# Altium project TSAL_Pedro_Leite.PrjPcb
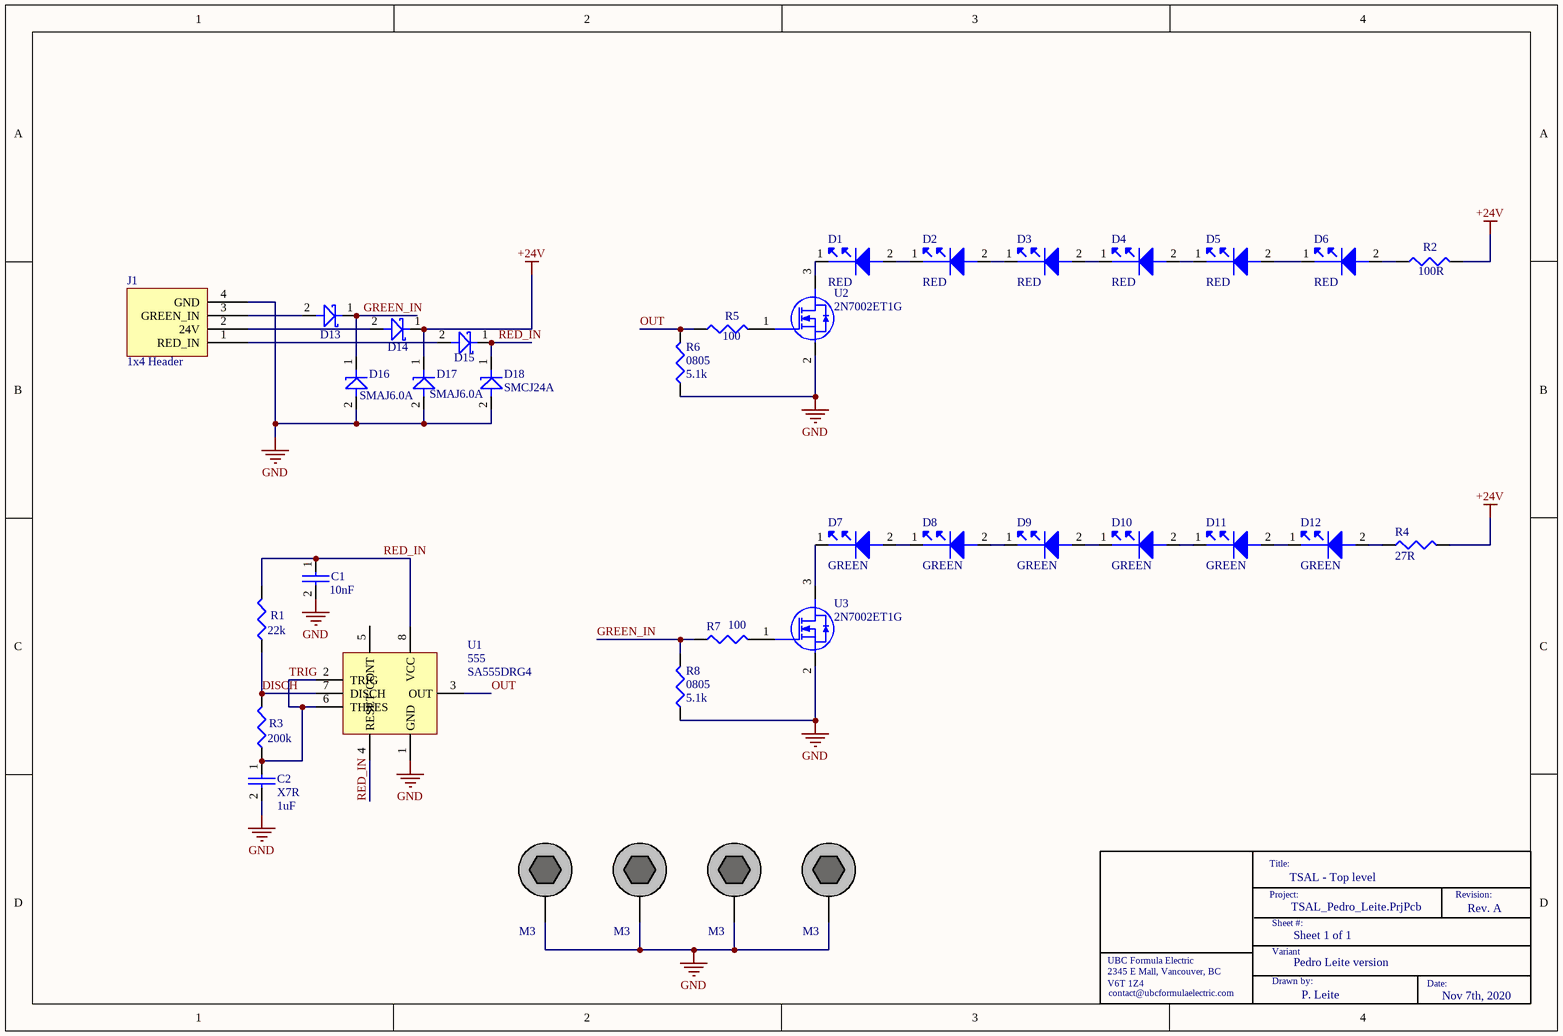
[diagram p0: TSAL_PL.SchDoc]
1 sheet, 37 parts. Net scope: global (net labels, ports and power ports of the same name join across sheets).
Board file: TSAL_PL_R1.PcbDoc

## Sheet TSAL_PL.SchDoc
size A4; Organization: Altium Limited; Address1: L3, 12a Rodborough Rd; Address2: Frenchs Forest; Address3: NSW; Address4: Australia 2086

### Parts
2  M3  [M3 Mounting Hole]
3  M3  [M3 Mounting Hole]
4  M3  [M3 Mounting Hole]
*  Title Box  (value not drawn)
C1  Capacitance: 10nF  [0603 CAPACITOR (TDK C-SERIES)]  (hidden comment: 0603)
C2  X7R  Capacitance: 1uF  [RESC0805X60N]
D1  RED  [RED LED]  (net tie)
D2  RED  [RED LED]  (net tie)
D3  RED  [RED LED]  (net tie)
D4  RED  [RED LED]  (net tie)
D5  RED  [RED LED]  (net tie)
D6  RED  [RED LED]  (net tie)
D7  GREEN  [GREEN LED]  (net tie)
D8  GREEN  [GREEN LED]  (net tie)
D9  GREEN  [GREEN LED]  (net tie)
D10  GREEN  [GREEN LED]  (net tie)
D11  GREEN  [GREEN LED]  (net tie)
D12  GREEN  [GREEN LED]  (net tie)
D13  NRVTS260ESFT1G  [ON NRVTS260ESFT1G]  (value not drawn)
D14  NRVTS260ESFT1G  [ON NRVTS260ESFT1G]  (value not drawn)
D15  NRVTS260ESFT1G  [ON NRVTS260ESFT1G]  (value not drawn)
D16  SMAJ6.0A  [LITTELFUSE SMAJ6.0A]
D17  SMAJ6.0A  [LITTELFUSE SMAJ6.0A]
D18  SMCJ24A  [LITTELFUSE SMCJ24A]
J1  1x4 Header  [HDR1x4]
M1  M3  [M3 Mounting Hole]
R1  Resistance: 22k  [0603 RESISTOR (YAGEO)]  (hidden comment: 0603)
R2  Resistence: 100R  [2010 RESISTOR (YAGEO)]  (hidden comment: 2010)
R3  Resistance: 200k  [0603 RESISTOR (YAGEO)]  (hidden comment: 0603)
R4  Resistance: 27R  [0805 RESISTOR (YAGEO)]  (hidden comment: RL1220S-270-F)
R5  Resistance: 100  [0805 RESISTOR (YAGEO)]  (hidden comment: 0805)
R6  0805  Resistance: 5.1k  [0805 RESISTOR (YAGEO)]
R7  Resistance: 100  [0805 RESISTOR (YAGEO)]  (hidden comment: 0805)
R8  0805  Resistance: 5.1k  [0805 RESISTOR (YAGEO)]
U1  555  [SOIC-8]
U2  2N7002ET1G  [2N7002ET1G]
U3  2N7002ET1G  [2N7002ET1G]

### Nets
+24V: D14.1 D17.1 R2.2 R4.2
GND: 2.1 3.1 4.1 C1.2 C2.2 D16.2 D17.2 D18.2 J1.4(GND) M1.1 R6.1 R8.1 U1.1(GND) U2.2(S) U3.2(S)
DISCH: R1.1 R3.2 U1.7(DISCH)
GREEN_IN: D13.1 D16.1 R7.1 R8.2
OUT: R5.1 R6.2 U1.3(OUT)
RED_IN: C1.1 D15.1 D18.1 R1.2 U1.4(RESET) U1.8(VCC)
TRIG: C2.1 R3.1 U1.2(TRIG) U1.6(THRES)
NetD1_1: D1.1 U2.3(D)
NetD1_2: D1.2 D2.1
NetD2_2: D2.2 D3.1
NetD3_2: D3.2 D4.1
NetD4_2: D4.2 D5.1
NetD5_2: D5.2 D6.1
NetD6_2: D6.2 R2.1
NetD7_1: D7.1 U3.3(D)
NetD7_2: D7.2 D8.1
NetD8_2: D8.2 D9.1
NetD9_2: D9.2 D10.1
NetD10_2: D10.2 D11.1
NetD11_2: D11.2 D12.1
NetD12_2: D12.2 R4.1
NetD13_2: D13.2 J1.3(GREEN_IN)
NetD14_2: D14.2 J1.2(24V)
NetD15_2: D15.2 J1.1(RED_IN)
NetR5_2: R5.2 U2.1(G)
NetR7_2: R7.2 U3.1(G)

Not connected (* = marked no-connect by the designer): U1 5(CONT)

### Notes on the sheet
- (in symbol Title Box) Title:; TSAL - Top level; Project:; Revision:; TSAL_Pedro_Leite.PrjPcb; Rev. A; Sheet #:; Sheet 1 of 1; Variant; UBC Formula Electric; Pedro Leite version; 2345 E Mall, Vancouver, BC; V6T 1Z4; Drawn by:; Date:; contact@ubcformulaelectric.com; P. Leite; Nov 7th, 2020

### Library data of the parts
2-4 M1 = M3 Mounting Hole
C1 = CL10B103KB8NNNC: Cap Ceramic 0.01uF 50VDC X7R 10% SMD 0603 Paper T/R; Manufacturer: Samsung; Voltage Rating (DC): 50V; Supplier 1: Digi-Key; Manufacturer Part Number: CL10B103KB8NNNC; RoHS: Yes; Category: Ceramic Capacitors; Stock 1: 3003971; Pricing 1: 1=0.10000, 10=0.02700, 50=0.01480, 100=0.01210, 500=0.00866, 1000=0.00681 (USD); Mount: Surface Mount; Case/Package: 0603; Case Code (Metric): 1608; Case Code (Imperial): 0603; Material: Ceramic; Contact Plating: Tin; Min Operating Temperature: -55°C; Max Operating Temperature: 125°C; Dielectric: X7R; Voltage: 50V; Tolerance: 10%; Voltage Rating: 50V; Package Quantity: 1; Packaging: Cut Tape; Length: 1.6mm; Height: 0.8mm; Depth: 0.8mm; Thickness: 0.035inch; Width: 0.031inch; Radiation Hardening: No; Lead Free: Lead Free; ComponentLink1URL: https://datasheet.ciiva.com/15195/getdatasheetpartid-357415-15195721.pdf?src-supplier=Verical; ComponentLink1Description: https://datasheet.ciiva.com/15195/getdatasheetpartid-357415-15195721.pdf?src-supplier=Verical; ComponentLink2URL: https://datasheet.ciiva.com/29198/457455-da-01-en-vs-kondensator-0603-29198644.pdf?src-supplier=Conrad; ComponentLink2Description: https://datasheet.ciiva.com/29198/457455-da-01-en-vs-kondensator-0603-29198644.pdf?src-supplier=Conrad; ComponentLink3URL: https://datasheet.ciiva.com/20173/71-0315-20173334.pdf?src-supplier=Rapid+Electronics; ComponentLink3Description: https://datasheet.ciiva.com/20173/71-0315-20173334.pdf?src-supplier=Rapid+Electronics; Supplier Part Number 1: 1276-1009-1-ND
C2 = CC0805KKX7R6BB105: YAGEO - CC0805KKX7R6BB105 - Keramikvielschichtkondensator, SMD, 1 µF, 10 V, 0805 [Metrisch 2012], ± 10%, X7R, Baureihe CC; Dielectric Material: Ceramic; Voltage Rating: 10V; Supplier 1: Digi-Key; Manufacturer: Yageo; Manufacturer Part Number: CC0805KKX7R6BB105; RoHS: Yes; Category: Ceramic Capacitors; Stock 1: 620418; Pricing 1: 1=0.16000, 10=0.11300, 50=0.06440, 100=0.05340, 500=0.03740, 1000=0.03097 (USD); Mount: Surface Mount; Case/Package: 0805; Number of Pins: 2; Case Code (Imperial): 0805; Case Code (Metric): 2012; Min Operating Temperature: -55°C; Max Operating Temperature: 125°C; Tolerance: 10%; Voltage Rating (DC): 10V; Packaging: Tape and Reel; Package Quantity: 1; Dielectric: X7R; Termination: SMD/SMT; Resistor Type: Ceramic; Length: 2mm; Width: 1.25mm; Height: 1.25mm; Thickness: 0.057inch; Depth: 1.25mm; Radiation Hardening: No; REACH SVHC: Unknown; Lead Free: Lead Free; Halogen Free: Halogen Free; ComponentLink1URL: https://datasheet.ciiva.com/13389/upy-gp-np0-16v-to-50v-8-13389349.pdf?src-supplier=Mouser; ComponentLink1Description: https://datasheet.ciiva.com/13389/upy-gp-np0-16v-to-50v-8-13389349.pdf?src-supplier=Mouser; ComponentLink2URL: https://datasheet.ciiva.com/46430/1734573-46430165.pdf?src-supplier=Element14; ComponentLink2Description: https://datasheet.ciiva.com/46430/1734573-46430165.pdf?src-supplier=Element14; ComponentLink3URL: https://datasheet.ciiva.com/28450/1489800-28450742.pdf?src-supplier=Element14; ComponentLink3Description: https://datasheet.ciiva.com/28450/1489800-28450742.pdf?src-supplier=Element14; ComponentLink4URL: https://datasheet.ciiva.com/7978/1489800-7978199.pdf?src-supplier=Element14; ComponentLink4Description: https://datasheet.ciiva.com/7978/1489800-7978199.pdf?src-supplier=Element14; ComponentLink5URL: https://datasheet.ciiva.com/176/mlccorderingcode-176908.pdf?src-supplier=Digi-Key; ComponentLink5Description: https://datasheet.ciiva.com/176/mlccorderingcode-176908.pdf?src-supplier=Digi-Key; ComponentLink6URL: https://datasheet.ciiva.com/11583/upy-gphc-x7r-6-3v-to-50v-8-11583596.pdf?src-supplier=Avnet; ComponentLink6Description: https://datasheet.ciiva.com/11583/upy-gphc-x7r-6-3v-to-50v-8-11583596.pdf?src-supplier=Avnet; ComponentLink7URL: https://datasheet.ciiva.com/176/mlccorderingcode-176909.pdf?src-supplier=Digi-Key; ComponentLink7Description: https://datasheet.ciiva.com/176/mlccorderingcode-176909.pdf?src-supplier=Digi-Key; ComponentLink8URL: https://datasheet.ciiva.com/8033/1489800-8033973.pdf?src-supplier=Element14; ComponentLink8Description: https://datasheet.ciiva.com/8033/1489800-8033973.pdf?src-supplier=Element14; ComponentLink9URL: https://datasheet.ciiva.com/17437/upy-gphc-x7r-6-3v-to-50v-8-17437525.pdf?src-supplier=Avnet+Europe; ComponentLink9Description: https://datasheet.ciiva.com/17437/upy-gphc-x7r-6-3v-to-50v-8-17437525.pdf?src-supplier=Avnet+Europe; ComponentLink10URL: https://datasheet.ciiva.com/176/mlccorderingcode-176907.pdf?src-supplier=Digi-Key; ComponentLink10Description: https://datasheet.ciiva.com/176/mlccorderingcode-176907.pdf?src-supplier=Digi-Key; ComponentLink11URL: https://datasheet.ciiva.com/8033/1489800-8033998.pdf?src-supplier=Element14; ComponentLink11Description: https://datasheet.ciiva.com/8033/1489800-8033998.pdf?src-supplier=Element14; Supplier Part Number 1: 311-1458-1-ND
D1-D6 = OVS5MRBCR4: LED 0.33W RED WTR CLR 3.5MM; Manufacturer: TT Optek; Reverse Voltage: 12V; Test Current: 150mA; Max Current Rating: 200mA; Dominant Wavelength: 625nm; Power Dissipation: 750mW; Number of Elements: 1; Max Power Dissipation: 330mW; Viewing Angle: 120°; Lens Style: Clear,Diffused,Colorless; Forward Voltage: 2.2V; Luminous Intensity: 7150mcd; Power Rating: 500mW; Supplier 1: Digi-Key; Manufacturer Part Number: OVS5MRBCR4; RoHS: Yes; Category: LEDs; Stock 1: 10132; Pricing 1: 1=0.96000, 100=0.92400, 250=0.88000, 500=0.85800 (USD); Mount: Surface Mount; Case/Package: SMD/SMT; Number of Pins: 2; Color: Red; Min Operating Temperature: -40°C; Max Operating Temperature: 100°C; Wavelength: 625nm; Packaging: Cut Tape; Package Quantity: 1; Illumination Color: Red; Forward Current: 200mA; Length: 3.5mm; Depth: 3.5mm; Lead Free: Lead Free; REACH SVHC: No SVHC; ComponentLink1URL: https://datasheet.ciiva.com/2126/ovs5mabcr4-2126832.pdf?src-supplier=Digi-Key; ComponentLink1Description: https://datasheet.ciiva.com/2126/ovs5mabcr4-2126832.pdf?src-supplier=Digi-Key; ComponentLink2URL: https://datasheet.ciiva.com/16224/ovs5mrbcr4-16224208.pdf?src-supplier=Future+Electronics; ComponentLink2Description: https://datasheet.ciiva.com/16224/ovs5mrbcr4-16224208.pdf?src-supplier=Future+Electronics; ComponentLink3URL: https://datasheet.ciiva.com/2126/ovs5mabcr4-2126833.pdf?src-supplier=Digi-Key; ComponentLink3Description: https://datasheet.ciiva.com/2126/ovs5mabcr4-2126833.pdf?src-supplier=Digi-Key; ComponentLink4URL: https://datasheet.ciiva.com/46403/ovs5mabcr4-46403613.pdf?src-supplier=Element14; ComponentLink4Description: https://datasheet.ciiva.com/46403/ovs5mabcr4-46403613.pdf?src-supplier=Element14; ComponentLink5URL: https://datasheet.ciiva.com/2126/ovs5mabcr4-2126831.pdf?src-supplier=Digi-Key; ComponentLink5Description: https://datasheet.ciiva.com/2126/ovs5mabcr4-2126831.pdf?src-supplier=Digi-Key; Supplier Part Number 1: 365-1546-1-ND
D7-D12 = XZDG25X109FS: Led 3.5X2.8 0.5W SMD Green; Manufacturer: SunLED; Lens Color: Colorless; Lens Style: Round,Flat; Lens Transparency: Clear; Luminous Intensity: 6990mcd; Forward Voltage: 3.5V; Test Current: 150mA; Viewing Angle: 120°; Dominant Wavelength: 525nm; Lens Size: 2.5mm; Supplier 1: Digi-Key; Manufacturer Part Number: XZDG25X109FS; RoHS: No; Category: LEDs; Stock 1: 1496; Pricing 1: 1=1.83000, 10=1.61300, 100=0.93630, 500=0.84640, 1000=0.72738 (USD); Mount: Surface Mount; Case/Package: 1411; Color: Green; Case Code (Imperial): 1411; Case Code (Metric): 3528; Packaging: Cut Tape; Length: 3.5mm; Width: 2.8mm; Height: 1.05mm; ComponentLink1URL: http://www.sunledusa.com/products/spec/XZDG25X109FS.pdf?src-supplier=Digi-Key; ComponentLink1Description: http://www.sunledusa.com/products/spec/XZDG25X109FS.pdf?src-supplier=Digi-Key; ComponentLink2URL: https://www.sunledusa.com/products/spec/XZDG25X109FS.pdf?src-supplier=Digi-Key; ComponentLink2Description: https://www.sunledusa.com/products/spec/XZDG25X109FS.pdf?src-supplier=Digi-Key; Supplier Part Number 1: 1497-1345-1-ND
D13-D15 = NRVTS260ESFT1G: ON SEMICONDUCTOR - NRVTS260ESFT1G - Schottky Rectifier, 60 V, 2 A, Single, SOD-123, 2 Pins, 650 mV; Max Reverse Voltage (DC): 60V; Average Rectified Current: 2A; Max Reverse Current: 12uA; Forward Voltage: 650mV; Max Forward Surge Current (Ifsm): 25A; Peak Non-Repetitive Surge Current: 50A; Supplier 1: Digi-Key; Manufacturer: ON Semiconductor; Manufacturer Part Number: NRVTS260ESFT1G; RoHS: Yes; Category: Schottky Diodes; Pricing 1: 1=0.34000, 10=0.22100, 100=0.11060, 500=0.09164, 1000=0.06004 (USD); Mount: Surface Mount; Case/Package: SOD; Number of Pins: 2; Min Operating Temperature: -65°C; Max Operating Temperature: 175°C; Packaging: Cut Tape; Reverse Voltage (DC): 60V; Forward Current: 2A; Max Repetitive Reverse Voltage (Vrrm): 60V; Element Configuration: Single; Package Quantity: 1; Length: 2.9mm; Width: 1.8mm; Height: 0.88mm; REACH SVHC: No SVHC; Lead Free: Lead Free; ComponentLink1URL: https://datasheet.ciiva.com/53019/nts260esf-d-53019548.pdf?src-supplier=Digi-Key; ComponentLink1Description: https://datasheet.ciiva.com/53019/nts260esf-d-53019548.pdf?src-supplier=Digi-Key; Supplier Part Number 1: NRVTS260ESFT1GOSCT-ND
D16 D17 = SMAJ6.0A: In a Pack of 25, Littelfuse SMAJ6.0A, Uni-Directional TVS Diode, 400W, 2-Pin DO-214AC; Direction: Unidirectional; Operating Supply Voltage: 6V; Max Surge Current: 38.8A; Reverse Breakdown Voltage: 66.7V; Number of Unidirectional Channels: 1; Min Breakdown Voltage: 6.67V; Clamping Voltage: 10.3V; Power Line Protection: No; Max Breakdown Voltage: 7.37V; Peak Pulse Current: 4.1A; Test Current: 1mA; Max Power Dissipation: 3.3W; Leakage Current: 1uA; Current: 41A; Voltage: 60V; Supplier 1: Digi-Key; Manufacturer: Littelfuse; Manufacturer Part Number: SMAJ6.0A; RoHS: Yes; Category: TVS Diodes; Stock 1: 50756; Pricing 1: 1=0.36000, 10=0.24800, 100=0.14180, 500=0.10800, 1000=0.07875, 2000=0.07650 (USD); Mount: Surface Mount; Number of Pins: 2; Min Operating Temperature: -55°C; Max Operating Temperature: 150°C; Package Quantity: 1; Packaging: Cut Tape; Reverse Standoff Voltage: 6V; Peak Pulse Power: 400W; Breakdown Voltage: 6.67V; Number of Channels: 1; Polarity: Unidirectional; Termination: SMD/SMT; Number of Elements: 1; Power Dissipation: 400W; Voltage Rating (DC): 6V; Resistor Type: Zener; Length: 5.28mm; Width: 2.79mm; Height: 2.29mm; Radiation Hardening: No; REACH SVHC: No SVHC; Lead Free: Lead Free; ComponentLink1URL: https://datasheet.ciiva.com/330/littelfuse-tvs-diode-smaj-datasheet-pdf-330721.pdf?src-supplier=Digi-Key; ComponentLink1Description: https://datasheet.ciiva.com/330/littelfuse-tvs-diode-smaj-datasheet-pdf-330721.pdf?src-supplier=Digi-Key; ComponentLink2URL: https://datasheet.ciiva.com/330/littelfuse-tvs-diode-smaj-datasheet-pdf-330722.pdf?src-supplier=Digi-Key; ComponentLink2Description: https://datasheet.ciiva.com/330/littelfuse-tvs-diode-smaj-datasheet-pdf-330722.pdf?src-supplier=Digi-Key; ComponentLink3URL: https://datasheet.ciiva.com/330/littelfuse-tvs-diode-smaj-datasheet-pdf-330723.pdf?src-supplier=Digi-Key; ComponentLink3Description: https://datasheet.ciiva.com/330/littelfuse-tvs-diode-smaj-datasheet-pdf-330723.pdf?src-supplier=Digi-Key; ComponentLink4URL: https://datasheet.ciiva.com/330/littelfuse-tvs-diode-smaj-datasheet-pdf-330712.pdf?src-supplier=Digi-Key; ComponentLink4Description: https://datasheet.ciiva.com/330/littelfuse-tvs-diode-smaj-datasheet-pdf-330712.pdf?src-supplier=Digi-Key; ComponentLink5URL: https://datasheet.ciiva.com/28473/607617-28473464.pdf?src-supplier=Element14; ComponentLink5Description: https://datasheet.ciiva.com/28473/607617-28473464.pdf?src-supplier=Element14; ComponentLink6URL: https://datasheet.ciiva.com/330/littelfuse-tvs-diode-smaj-datasheet-pdf-330713.pdf?src-supplier=Digi-Key; ComponentLink6Description: https://datasheet.ciiva.com/330/littelfuse-tvs-diode-smaj-datasheet-pdf-330713.pdf?src-supplier=Digi-Key; ComponentLink7URL: https://datasheet.ciiva.com/16391/littelfuse-tvs-diode-smaj-16391801.pdf?src-supplier=Future+Electronics; ComponentLink7Description: https://datasheet.ciiva.com/16391/littelfuse-tvs-diode-smaj-16391801.pdf?src-supplier=Future+Electronics; ComponentLink8URL: https://datasheet.ciiva.com/16487/littelfuse-tvs-diode-smaj-16487499.pdf?src-supplier=Future+Electronics; ComponentLink8Description: https://datasheet.ciiva.com/16487/littelfuse-tvs-diode-smaj-16487499.pdf?src-supplier=Future+Electronics; Supplier Part Number 1: SMAJ6.0ALFCT-ND
D18 = SMCJ24A: LITTELFUSE - SMCJ24A - TVS Diode, TRANSZORB SMCJ Series, Unidirectional, 24 V, 38.9 V, DO-214AB (SMC), 2 Pins; Operating Supply Voltage: 24V; Max Surge Current: 38.6A; Clamping Voltage: 38.9V; Peak Pulse Power: 1.5kW; Number of Channels: 1; Breakdown Voltage: 26.7V; Power Line Protection: No; Max Breakdown Voltage: 29.5V; Test Current: 1mA; Max Reverse Leakage Current: 1uA; Max Power Dissipation: 6.5W; Element Configuration: Single; Supplier 1: Digi-Key; Manufacturer: Littelfuse; Manufacturer Part Number: SMCJ24A; RoHS: Yes; Category: Diodes; Stock 1: 17092; Pricing 1: 1=0.55000, 10=0.43800, 100=0.31250, 500=0.23750, 1000=0.18750 (USD); Mount: Surface Mount; Number of Pins: 2; Min Operating Temperature: -65°C; Max Operating Temperature: 150°C; Packaging: Cut Tape; Package Quantity: 1; Polarity: Unidirectional; Voltage Rating (DC): 24V; Direction: Unidirectional; Reverse Breakdown Voltage: 26.7V; Number of Elements: 1; Number of Unidirectional Channels: 1; Reverse Standoff Voltage: 24V; Min Breakdown Voltage: 26.7V; Termination: SMD/SMT; Power Dissipation: 1.5kW; Peak Pulse Current: 38.6A; Leakage Current: 1uA; Resistor Type: Zener; Length: 7.11mm; Width: 6.22mm; Height: 2.417mm; REACH SVHC: No SVHC; Lead Free: Lead Free; ComponentLink1URL: https://datasheet.ciiva.com/341/littelfuse-tvs-diode-smcj-datasheet-pdf-341029.pdf?src-supplier=Digi-Key; ComponentLink1Description: https://datasheet.ciiva.com/341/littelfuse-tvs-diode-smcj-datasheet-pdf-341029.pdf?src-supplier=Digi-Key; ComponentLink2URL: https://datasheet.ciiva.com/8062/littelfuse-tvs-diode-smcj-8062373.pdf?src-supplier=Element14; ComponentLink2Description: https://datasheet.ciiva.com/8062/littelfuse-tvs-diode-smcj-8062373.pdf?src-supplier=Element14; ComponentLink3URL: https://datasheet.ciiva.com/341/littelfuse-tvs-diode-smcj-datasheet-pdf-341030.pdf?src-supplier=Digi-Key; ComponentLink3Description: https://datasheet.ciiva.com/341/littelfuse-tvs-diode-smcj-datasheet-pdf-341030.pdf?src-supplier=Digi-Key; ComponentLink4URL: https://datasheet.ciiva.com/341/littelfuse-tvs-diode-smcj-datasheet-pdf-341031.pdf?src-supplier=Digi-Key; ComponentLink4Description: https://datasheet.ciiva.com/341/littelfuse-tvs-diode-smcj-datasheet-pdf-341031.pdf?src-supplier=Digi-Key; Supplier Part Number 1: SMCJ24ALFCT-ND
J1 = 22-27-2041: Conn Wire to Board HDR 4 POS 2.54mm Solder ST Thru-Hole Bag; Manufacturer: Molex; Number of Positions: 4; Connector Type: Male Pin; Gender: Male; Contact Resistance: 10mR; Supplier 1: Digi-Key; Manufacturer Part Number: 22-27-2041; RoHS: Yes; Category: Headers and Wire Housings; Stock 1: 5089; Pricing 1: 1=0.40000, 10=0.38300, 100=0.26800, 500=0.22974, 1000=0.19145, 5000=0.16410, 10000=0.15316 (USD); Mount: Surface Mount; Color: Natural; Housing Color: White; Housing Material: Nylon; Contact Material: Brass; Contact Plating: Tin,Copper; Min Operating Temperature: 0°C; Max Operating Temperature: 75°C; Number of Rows: 1; Packaging: Cut Tape; Termination: Solder; Orientation: Straight; Number of Contacts: 4; Fastening Type: Friction; Length: 10.16mm; Pitch: 2.54mm; Depth: 5.8mm; Contact Mating Length: 0.295inch; ComponentLink1URL: https://datasheet.ciiva.com/6813/022272021-sd-6813678.pdf?src-supplier=Digi-Key; ComponentLink1Description: https://datasheet.ciiva.com/6813/022272021-sd-6813678.pdf?src-supplier=Digi-Key; ComponentLink2URL: https://datasheet.ciiva.com/7844/1625756-7844114.pdf?src-supplier=Element14; ComponentLink2Description: https://datasheet.ciiva.com/7844/1625756-7844114.pdf?src-supplier=Element14; ComponentLink3URL: https://datasheet.ciiva.com/11746/0900766b80462714-11746241.pdf?src-supplier=RSComponents; ComponentLink3Description: https://datasheet.ciiva.com/11746/0900766b80462714-11746241.pdf?src-supplier=RSComponents; ComponentLink4URL: https://datasheet.ciiva.com/20207/22-0838e-20207115.pdf?src-supplier=Rapid+Electronics; ComponentLink4Description: https://datasheet.ciiva.com/20207/22-0838e-20207115.pdf?src-supplier=Rapid+Electronics; ComponentLink5URL: https://datasheet.ciiva.com/15217/getdatasheetpartid-176661-15217685.pdf?src-supplier=Verical; ComponentLink5Description: https://datasheet.ciiva.com/15217/getdatasheetpartid-176661-15217685.pdf?src-supplier=Verical; ComponentLink6URL: https://datasheet.ciiva.com/49385/879300-49385686.pdf?src-supplier=Jameco; ComponentLink6Description: https://datasheet.ciiva.com/49385/879300-49385686.pdf?src-supplier=Jameco; Supplier Part Number 1: WM4113-ND
R1 = CRCW060322K0FKEAC: Res Thick Film 0603 22K Ohm 1% 1/10W ±100ppm/°C Molded SMD Paper T/R; Manufacturer: Vishay Semiconductors; Power Rating: 100mW; Supplier 1: Digi-Key; Manufacturer Part Number: CRCW060322K0FKEAC; RoHS: Yes; Category: Resistors; Stock 1: 48223; Pricing 1: 1=0.10000, 10=0.03100, 100=0.01260, 1000=0.00567, 2500=0.00492 (USD); Mount: Surface Mount; Case/Package: Molded; Contact Plating: Tin; Min Operating Temperature: -55°C; Max Operating Temperature: 155°C; Resistor Type: Thick Film; Termination: Wraparound; Tolerance: 1%; Temperature Coefficient: 100ppm/°C; Length: 1.55mm; Lead Free: Lead Free; ComponentLink1URL: http://www.vishay.com/docs/28773/crcwce3.pdf?src-supplier=Digi-Key; ComponentLink1Description: http://www.vishay.com/docs/28773/crcwce3.pdf?src-supplier=Digi-Key; ComponentLink2URL: http://www.vishay.com/docs/20035/dcrcwe3.pdf?src-supplier=Avnet+Asia; ComponentLink2Description: http://www.vishay.com/docs/20035/dcrcwe3.pdf?src-supplier=Avnet+Asia; Supplier Part Number 1: 541-4036-1-ND
R2 = 2010: TE CONNECTIVITY - CRGP2010F100R - RES, 100R, 1%, 1.25W, 2010, THICK FILM; Supplier 1: Digi-Key; Manufacturer: TE Connectivity; Manufacturer Part Number: CRGP2010F100R; RoHS: No; Category: Chip SMD Resistors; Stock 1: 14514; Pricing 1: 1=0.37000, 10=0.28600, 100=0.12040, 1000=0.06643 (USD); ComponentLink1URL: https://www.te.com/commerce/DocumentDelivery/DDEController?Action=srchrtrv&amp;DocNm=9-1773463-9&amp;DocType=DS&amp;DocLang=English&src-supplier=Digi-Key; ComponentLink1Description: https://www.te.com/commerce/DocumentDelivery/DDEController?Action=srchrtrv&amp;DocNm=9-1773463-9&amp;DocType=DS&amp;DocLang=English&src-supplier=Digi-Key; ComponentLink2URL: https://4donline.ihs.com/images/VipMasterIC/IC/TYEL/TYEL-S-A0005460475/TYEL-S-A0005460475-1.pdf?hkey=52A5661711E402568146F3353EA87419&src-supplier=Farnell; ComponentLink2Description: https://4donline.ihs.com/images/VipMasterIC/IC/TYEL/TYEL-S-A0005460475/TYEL-S-A0005460475-1.pdf?hkey=52A5661711E402568146F3353EA87419&src-supplier=Farnell; ComponentLink3URL: https://4donline.ihs.com/images/VipMasterIC/IC/TYEL/TYEL-S-A0005460475/TYEL-S-A0005460475-1.pdf?hkey=52A5661711E402568146F3353EA87419&src-supplier=Newark; ComponentLink3Description: https://4donline.ihs.com/images/VipMasterIC/IC/TYEL/TYEL-S-A0005460475/TYEL-S-A0005460475-1.pdf?hkey=52A5661711E402568146F3353EA87419&src-supplier=Newark; Supplier Part Number 1: A130648CT-ND
R3 = CRCW0603200KFKEAC: Res Thick Film 0603 200K Ohm 1% 1/10W ±100ppm/°C Molded SMD Paper T/R; Manufacturer: Vishay; Power Rating: 100mW; Supplier 1: Digi-Key; Manufacturer Part Number: CRCW0603200KFKEAC; RoHS: Yes; Category: Resistors; Stock 1: 12235; Pricing 1: 1=0.10000, 10=0.03100, 100=0.01260, 1000=0.00567, 2500=0.00492 (USD); Mount: Surface Mount; Case/Package: Molded; Contact Plating: Tin; Min Operating Temperature: -55°C; Max Operating Temperature: 155°C; Resistor Type: Thick Film; Termination: Wraparound; Temperature Coefficient: 100ppm/°C; Tolerance: 1%; Length: 1.55mm; Lead Free: Lead Free; ComponentLink1URL: http://www.vishay.com/docs/28773/crcwce3.pdf?src-supplier=Digi-Key; ComponentLink1Description: http://www.vishay.com/docs/28773/crcwce3.pdf?src-supplier=Digi-Key; Supplier Part Number 1: 541-4027-1-ND
R4 = RL1220S-270-F: RES SMD 27 OHM 1% 1/3W 0805; Manufacturer: Susumu; Supplier 1: Digi-Key; Manufacturer Part Number: RL1220S-270-F; RoHS: Yes; Category: Chip SMD Resistors; Stock 1: 2466; Pricing 1: 1=0.34000, 10=0.28900, 25=0.21000, 50=0.15220, 100=0.11290, 250=0.08664, 500=0.06826, 1000=0.04725 (USD); Case/Package: 0805; Weight: 0.000194oz; Termination: SMD/SMT; Packaging: Cut Tape; Package Quantity: 1; Length: 2mm; Width: 1.25mm; Height: 0.4mm; ComponentLink1URL: http://www.mouser.com/ds/2/392/RL_Data_sheet-263250.pdf?src-supplier=Mouser; ComponentLink1Description: http://www.mouser.com/ds/2/392/RL_Data_sheet-263250.pdf?src-supplier=Mouser; ComponentLink2URL: http://www.susumu.co.jp/common/pdf/n_catalog_partition08_en.pdf?src-supplier=Digi-Key; ComponentLink2Description: http://www.susumu.co.jp/common/pdf/n_catalog_partition08_en.pdf?src-supplier=Digi-Key; Supplier Part Number 1: 408-1396-1-ND
R5 R7 = RT0805DRD07100RL: RES SMD 100 OHM 0.5% 1/8W 0805; Manufacturer: Yageo; Temperature Coefficient: 25ppm/°C; Power Rating: 125mW; Voltage Rating (DC): 150V; Supplier 1: Digi-Key; Manufacturer Part Number: RT0805DRD07100RL; RoHS: Yes; Category: Chip SMD Resistors; Stock 1: 7222; Pricing 1: 1=0.23000, 10=0.19200, 100=0.07490, 1000=0.03137, 2500=0.02876 (USD); Case/Package: 0805; Contact Plating: Tin,Matte; Case Code (Metric): 2012; Case Code (Imperial): 0805; Min Operating Temperature: -55°C; Max Operating Temperature: 155°C; Tolerance: 0.5%; Resistor Type: Thin Film; Package Quantity: 1; Packaging: Cut Tape; Number of Terminations: 2; Max Power Dissipation: 125mW; Features: Moisture Resistant; Length: 0.079inch; Width: 0.049inch; Height: 0.024inch; Radiation Hardening: No; Lead Free: Lead Free; ComponentLink1URL: https://datasheet.ciiva.com/2575/pyu-rt-1-to-0-05-rohs-l-5-2575581.pdf?src-supplier=Digi-Key; ComponentLink1Description: https://datasheet.ciiva.com/2575/pyu-rt-1-to-0-05-rohs-l-5-2575581.pdf?src-supplier=Digi-Key; Supplier Part Number 1: 311-2698-1-ND
R6 R8 = RC0805JR-075K1L: Res Thick Film 0805 5.1K Ohm 5% 0.125W(1/8W) ±100ppm/C Epoxy Pad SMD T/R; Manufacturer: Yageo; Power Rating: 125mW; Voltage Rating: 150V; Temperature Coefficient: 100ppm/°C; Supplier 1: Digi-Key; Manufacturer Part Number: RC0805JR-075K1L; RoHS: Yes; Category: Chip SMD Resistors; Stock 1: 146225; Pricing 1: 1=0.10000, 10=0.03100, 100=0.01270, 1000=0.00572, 2500=0.00497 (USD); Case/Package: 0805; Number of Pins: 2; Case Code (Metric): 2012; Case Code (Imperial): 0805; Contact Plating: Tin,Matte,Lead; Weight: 0.000194oz; Min Operating Temperature: -55°C; Max Operating Temperature: 155°C; Tolerance: 5%; Package Quantity: 1; Packaging: Tape and Reel; Resistor Type: Thick Film; Number of Terminations: 2; Termination: SMD/SMT; Max Power Dissipation: 125mW; Voltage Rating (DC): 150V; Features: Moisture Resistant; Length: 2mm; Width: 0.049inch; Height: 0.024inch; Depth: 1.25mm; Radiation Hardening: No; Military Standard: Not; Lead Free: Lead Free; REACH SVHC: No SVHC; ComponentLink1URL: https://datasheet.ciiva.com/2456/pyu-r-int-thick-7-2456155.pdf?src-supplier=Digi-Key; ComponentLink1Description: https://datasheet.ciiva.com/2456/pyu-r-int-thick-7-2456155.pdf?src-supplier=Digi-Key; ComponentLink2URL: https://datasheet.ciiva.com/15190/getdatasheetpartid-329214-15190059.pdf?src-supplier=Verical; ComponentLink2Description: https://datasheet.ciiva.com/15190/getdatasheetpartid-329214-15190059.pdf?src-supplier=Verical; ComponentLink3URL: https://datasheet.ciiva.com/2456/pyu-r-int-thick-7-2456156.pdf?src-supplier=Digi-Key; ComponentLink3Description: https://datasheet.ciiva.com/2456/pyu-r-int-thick-7-2456156.pdf?src-supplier=Digi-Key; ComponentLink4URL: https://datasheet.ciiva.com/2456/pyu-r-int-thick-7-2456157.pdf?src-supplier=Digi-Key; ComponentLink4Description: https://datasheet.ciiva.com/2456/pyu-r-int-thick-7-2456157.pdf?src-supplier=Digi-Key; ComponentLink5URL: https://datasheet.ciiva.com/12577/rc0805-12577711.pdf?src-supplier=Mouser; ComponentLink5Description: https://datasheet.ciiva.com/12577/rc0805-12577711.pdf?src-supplier=Mouser; Supplier Part Number 1: 311-5.1KARCT-ND
U1 = SA555DRG4: IC OSC SGL TIMER 100KHZ 8-SOIC; Manufacturer: Texas Instruments; Min Supply Voltage: 4.5V; Max Supply Voltage: 16V; Nominal Supply Current: 2mA; Operating Supply Current: 10mA; Number of Timers/Counters: 1; Quiescent Current: 15mA; High Level Output Current: -200mA; Low Level Output Current: 200mA; Supplier 1: Digi-Key; Manufacturer Part Number: SA555DRG4; RoHS: Yes; Category: Timers and Oscillators; Stock 1: 1131; Pricing 1: 1=0.39000, 10=0.31500, 25=0.28800, 100=0.21440, 250=0.19432, 500=0.16080, 1000=0.12060 (USD); Mount: Surface Mount; Case/Package: SOIC; Number of Pins: 8; Weight: 0.002561oz; Min Operating Temperature: -40°C; Max Operating Temperature: 85°C; Packaging: Cut Tape; Package Quantity: 1; Frequency: 100kHz; Radiation Hardening: No; Lead Free: Lead Free; ComponentLink1URL: https://datasheet.ciiva.com/26943/getdatasheetpartid-624446-26943897.pdf?src-supplier=Verical; ComponentLink1Description: https://datasheet.ciiva.com/26943/getdatasheetpartid-624446-26943897.pdf?src-supplier=Verical; ComponentLink2URL: https://datasheet.ciiva.com/1235/sa555-1235928.pdf?src-supplier=Digi-Key; ComponentLink2Description: https://datasheet.ciiva.com/1235/sa555-1235928.pdf?src-supplier=Digi-Key; ComponentLink3URL: https://datasheet.ciiva.com/14274/se555m-14274518.pdf?src-supplier=Avnet; ComponentLink3Description: https://datasheet.ciiva.com/14274/se555m-14274518.pdf?src-supplier=Avnet; Supplier Part Number 1: 296-48948-1-ND
U2 U3 = 2N7002ET1G: Trans MOSFET N-CH 60V 0.26A 3-Pin SOT-23 T/R; Manufacturer: ON Semiconductor; Continuous Drain Current (ID): 260mA; Turn-Off Delay Time: 4.8ns; Turn-On Delay Time: 1.7ns; Gate to Source Voltage (Vgs): 20V; Rds On Max: 2.5R; Input Capacitance: 26.7pF; Rise Time: 1.2ns; Max Power Dissipation: 300mW; Element Configuration: Single; Nominal Vgs: 1V; Number of Elements: 1; Supplier 1: Digi-Key; Manufacturer Part Number: 2N7002ET1G; RoHS: Yes; Category: MOSFETs; Stock 1: 151215; Pricing 1: 1=0.18000, 10=0.16300, 25=0.15520, 100=0.06820, 500=0.05356, 1000=0.03720 (USD); Case/Package: SOT-23-3; Number of Pins: 3; Min Operating Temperature: -55°C; Max Operating Temperature: 150°C; Package Quantity: 1; Packaging: Cut Tape; Fall Time: 1.2ns; Drain to Source Resistance: 2.5R; On-State Resistance: 2.5R; Drain to Source Breakdown Voltage: 60V; Power Dissipation: 300mW; Threshold Voltage: 1V; Length: 2.9mm; Width: 1.3mm; Height: 0.94mm; Radiation Hardening: No; Lead Free: Lead Free; REACH SVHC: No SVHC; Halogen Free: Halogen Free; ComponentLink1URL: https://datasheet.ciiva.com/936/2n7002e-d-936787.pdf?src-supplier=Digi-Key; ComponentLink1Description: https://datasheet.ciiva.com/936/2n7002e-d-936787.pdf?src-supplier=Digi-Key; ComponentLink2URL: https://datasheet.ciiva.com/8059/2n7002e-d-8059427.pdf?src-supplier=Element14; ComponentLink2Description: https://datasheet.ciiva.com/8059/2n7002e-d-8059427.pdf?src-supplier=Element14; ComponentLink3URL: https://datasheet.ciiva.com/13060/2n7002e-d-105476-13060091.pdf?src-supplier=Mouser; ComponentLink3Description: https://datasheet.ciiva.com/13060/2n7002e-d-105476-13060091.pdf?src-supplier=Mouser; ComponentLink4URL: https://datasheet.ciiva.com/26146/2n7002e-d-26146200.pdf?src-supplier=Avnet+Europe; ComponentLink4Description: https://datasheet.ciiva.com/26146/2n7002e-d-26146200.pdf?src-supplier=Avnet+Europe; ComponentLink5URL: https://datasheet.ciiva.com/49018/70339334-49018202.pdf?src-supplier=Allied+Electronics; ComponentLink5Description: https://datasheet.ciiva.com/49018/70339334-49018202.pdf?src-supplier=Allied+Electronics; ComponentLink6URL: https://datasheet.ciiva.com/22641/1708226-22641627.pdf?src-supplier=Element14; ComponentLink6Description: https://datasheet.ciiva.com/22641/1708226-22641627.pdf?src-supplier=Element14; ComponentLink7URL: https://datasheet.ciiva.com/22641/1708226-22641628.pdf?src-supplier=Element14; ComponentLink7Description: https://datasheet.ciiva.com/22641/1708226-22641628.pdf?src-supplier=Element14; ComponentLink8URL: https://datasheet.ciiva.com/936/2n7002e-d-936788.pdf?src-supplier=Digi-Key; ComponentLink8Description: https://datasheet.ciiva.com/936/2n7002e-d-936788.pdf?src-supplier=Digi-Key; ComponentLink9URL: https://datasheet.ciiva.com/936/2n7002e-d-936789.pdf?src-supplier=Digi-Key; ComponentLink9Description: https://datasheet.ciiva.com/936/2n7002e-d-936789.pdf?src-supplier=Digi-Key; ComponentLink10URL: https://datasheet.ciiva.com/3304/2n7002e-d-3304389.pdf?src-supplier=Avnet; ComponentLink10Description: https://datasheet.ciiva.com/3304/2n7002e-d-3304389.pdf?src-supplier=Avnet; ComponentLink11URL: https://datasheet.ciiva.com/3304/2n7002e-d-3304390.pdf?src-supplier=Avnet; ComponentLink11Description: https://datasheet.ciiva.com/3304/2n7002e-d-3304390.pdf?src-supplier=Avnet; ComponentLink12URL: https://datasheet.ciiva.com/15198/getdatasheetpartid-53846-15198758.pdf?src-supplier=Verical; ComponentLink12Description: https://datasheet.ciiva.com/15198/getdatasheetpartid-53846-15198758.pdf?src-supplier=Verical; ComponentLink13URL: https://datasheet.ciiva.com/16305/2n7002e-d-16305452.pdf?src-supplier=Future+Electronics; ComponentLink13Description: https://datasheet.ciiva.com/16305/2n7002e-d-16305452.pdf?src-supplier=Future+Electronics; Supplier Part Number 1: 2N7002ET1GOSCT-ND